# Altium schematic sheet New ESC.SchDoc
size A
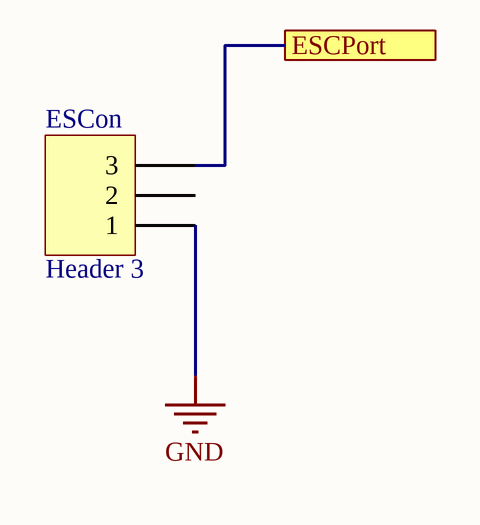
[diagram p0: New ESC.SchDoc]

## Parts
ESCon  Header 3  [HDR1X3]

## Ports
ESCPort

## Nets
GND: ESCon.1
ESCPort: ESCon.3 ; port ESCPort

Not connected (* = marked no-connect by the designer): ESCon 2

## Library data of the parts
ESCon = Header 3: Header, 3-Pin; LatestRevisionDate: 17-Jul-2002; LatestRevisionNote: Re-released for DXP Platform.; Publisher: Altium Limited